# Altium project Xenon.PrjPcb
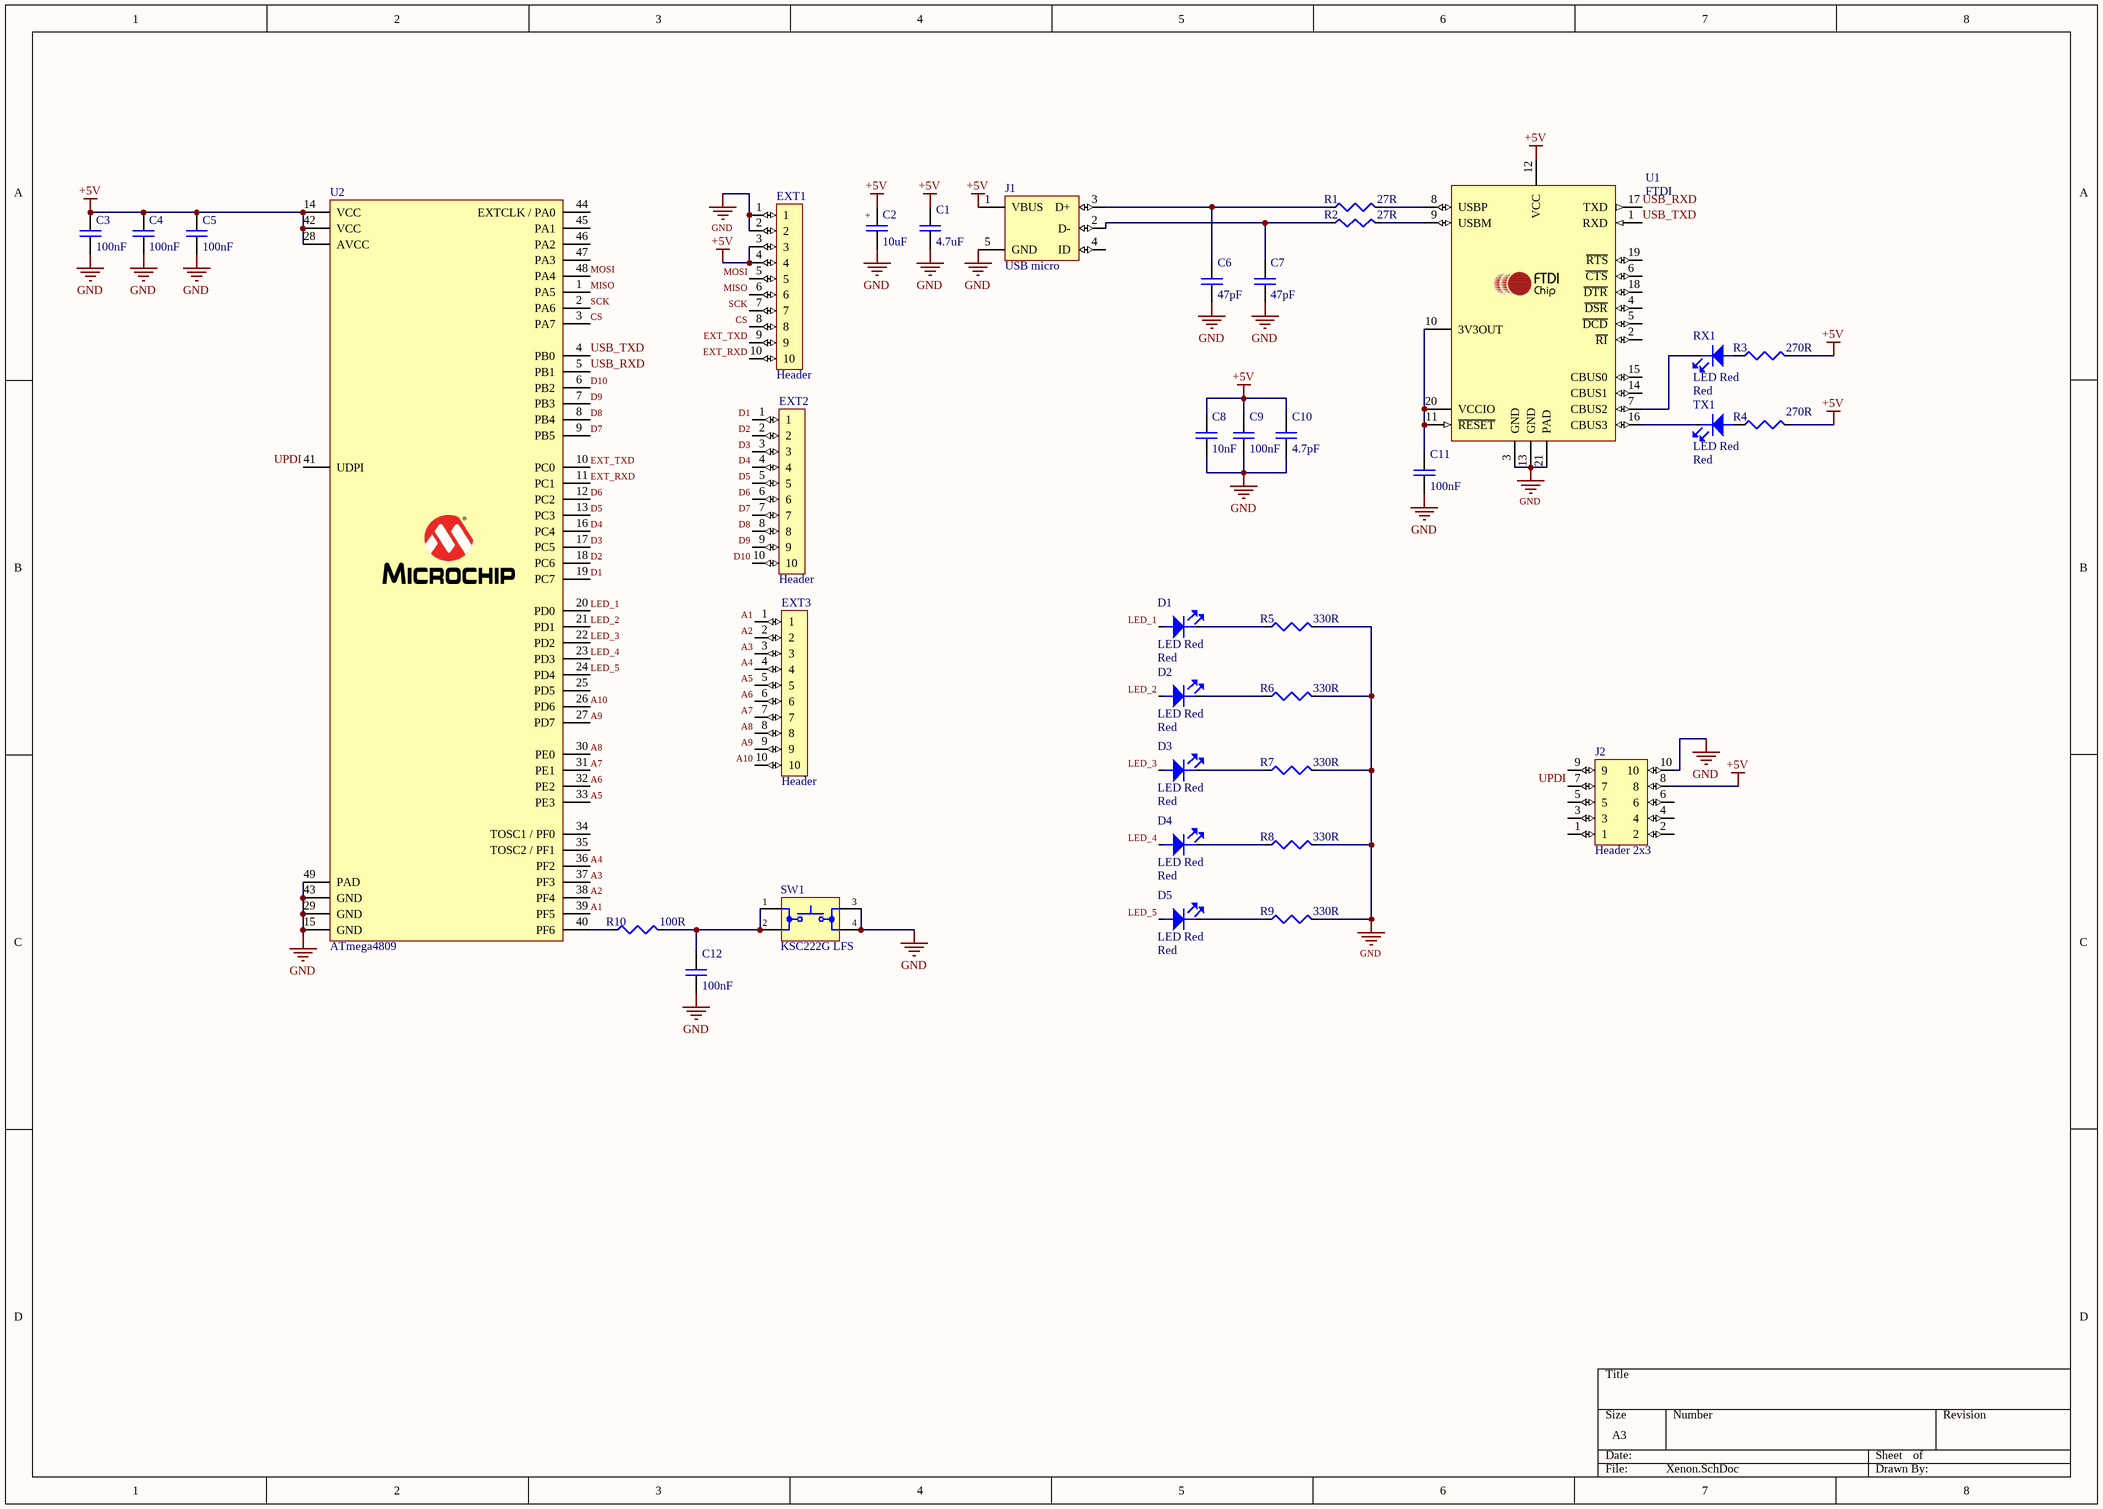
[diagram p0: Xenon.SchDoc]
1 sheet, 37 parts. Net scope: global (net labels, ports and power ports of the same name join across sheets).
Board file: Xenon.PcbDoc

## Sheet Xenon.SchDoc
size A3

### Parts
C1  value 4.7uF  [C0603]  (hidden comment: 02016D104KAT2A)
C2  value 10uF  [293D106X9020C2TE3]  (hidden comment: 293D106X9020C2TE3)
C3  value 100nF  [C0603]  (hidden comment: 02016D104KAT2A)
C4  value 100nF  [C0603]  (hidden comment: 02016D104KAT2A)
C5  value 100nF  [C0603]  (hidden comment: 02016D104KAT2A)
C6  value 47pF  [C0603]  (hidden comment: 02016D104KAT2A)
C7  value 47pF  [C0603]  (hidden comment: 02016D104KAT2A)
C8  value 10nF  [C0603]  (hidden comment: 02016D104KAT2A)
C9  value 100nF  [C0603]  (hidden comment: 02016D104KAT2A)
C10  value 4.7pF  [C0603]  (hidden comment: 02016D104KAT2A)
C11  value 100nF  [C0603]  (hidden comment: 02016D104KAT2A)
C12  value 100nF  [C0603]  (hidden comment: 02016D104KAT2A)
D1  LED Red  Color: Red  [L0603 RED]
D2  LED Red  Color: Red  [L0603 RED]
D3  LED Red  Color: Red  [L0603 RED]
D4  LED Red  Color: Red  [L0603 RED]
D5  LED Red  Color: Red  [L0603 RED]
EXT1  Header  [Header 1x10 2.54mm]
EXT2  Header  [Header 1x10 2.54mm]
EXT3  Header  [Header 1x10 2.54mm]
J1  USB micro  [USB micro]
J2  Header 2x3  [Header 2x5 1.27mm]
R1  value 27R  [R0603]  (hidden comment: CPF-A-0603B100KE1)
R2  value 27R  [R0603]  (hidden comment: CPF-A-0603B100KE1)
R3  value 270R  [R0603]  (hidden comment: CPF-A-0603B100KE1)
R4  value 270R  [R0603]  (hidden comment: CPF-A-0603B100KE1)
R5  value 330R  [R0603]  (hidden comment: CPF-A-0603B100KE1)
R6  value 330R  [R0603]  (hidden comment: CPF-A-0603B100KE1)
R7  value 330R  [R0603]  (hidden comment: CPF-A-0603B100KE1)
R8  value 330R  [R0603]  (hidden comment: CPF-A-0603B100KE1)
R9  value 330R  [R0603]  (hidden comment: CPF-A-0603B100KE1)
R10  value 100R  [R0603]  (hidden comment: CPF-A-0603B100KE1)
RX1  LED Red  Color: Red  [L0603 RED]
SW1  KSC222G LFS  [KSC222G LFS]
TX1  LED Red  Color: Red  [L0603 RED]
U1  FTDI  [FT231XQ-R]
U2  ATmega4809  [ATMEGA4809-MFR]

### Nets
+5V: C1.2 C2.1 C3.2 C4.2 C5.2 C8.2 C9.2 C10.2 EXT1.3 EXT1.4 J1.1(VBUS) J2.8 R3.2 R4.2 U1.12(VCC) U2.14(VCC) U2.28(AVCC) U2.42(VCC)
GND: C1.1 C2.2 C3.1 C4.1 C5.1 C6.1 C7.1 C8.1 C9.1 C10.1 C11.1 C12.1 EXT1.1 EXT1.2 J1.5(GND) J2.10 R5.2 R6.2 R7.2 R8.2 R9.2 SW1.3 SW1.4 U1.3(GND) U1.13(GND) U1.21(PAD) U2.15(GND) U2.29(GND) U2.43(GND) U2.49(PAD)
A1: EXT3.1 U2.39(PF5)
A2: EXT3.2 U2.38(PF4)
A3: EXT3.3 U2.37(PF3)
A4: EXT3.4 U2.36(PF2)
A5: EXT3.5 U2.33(PE3)
A6: EXT3.6 U2.32(PE2)
A7: EXT3.7 U2.31(PE1)
A8: EXT3.8 U2.30(PE0)
A9: EXT3.9 U2.27(PD7)
A10: EXT3.10 U2.26(PD6)
CS: EXT1.8 U2.3(PA7)
D1: EXT2.1 U2.19(PC7)
D2: EXT2.2 U2.18(PC6)
D3: EXT2.3 U2.17(PC5)
D4: EXT2.4 U2.16(PC4)
D5: EXT2.5 U2.13(PC3)
D6: EXT2.6 U2.12(PC2)
D7: EXT2.7 U2.9(PB5)
D8: EXT2.8 U2.8(PB4)
D9: EXT2.9 U2.7(PB3)
D10: EXT2.10 U2.6(PB2)
EXT_RXD: EXT1.10 U2.11(PC1)
EXT_TXD: EXT1.9 U2.10(PC0)
LED_1: D1.1 U2.20(PD0)
LED_2: D2.1 U2.21(PD1)
LED_3: D3.1 U2.22(PD2)
LED_4: D4.1 U2.23(PD3)
LED_5: D5.1 U2.24(PD4)
MISO: EXT1.6 U2.1(PA5)
MOSI: EXT1.5 U2.48(PA4)
SCK: EXT1.7 U2.2(PA6)
UPDI: J2.7 U2.41(UDPI)
USB_RXD: U1.17(TXD) U2.5(PB1)
USB_TXD: U1.1(RXD) U2.4(PB0)
NetC6_2: C6.2 J1.3(D+) R1.1
NetC7_2: C7.2 J1.2(D-) R2.1
NetC11_2: C11.2 U1.10(3V3OUT) U1.11(~{RESET}) U1.20(VCCIO)
NetC12_2: C12.2 R10.2 SW1.1 SW1.2
NetD1_2: D1.2 R5.1
NetD2_2: D2.2 R6.1
NetD3_2: D3.2 R7.1
NetD4_2: D4.2 R8.1
NetD5_2: D5.2 R9.1
NetR1_2: R1.2 U1.8(USBP)
NetR2_2: R2.2 U1.9(USBM)
NetR3_1: R3.1 RX1.1
NetR4_1: R4.1 TX1.1
NetR10_1: R10.1 U2.40(PF6)
NetRX1_2: RX1.2 U1.7(CBUS2)
NetTX1_2: TX1.2 U1.16(CBUS3)

Not connected (* = marked no-connect by the designer): J1 4(ID); J2 1 2 3 4 5 6 9; U1 2(~{RI}) 4(~{DSR}) 5(~{DCD}) 6(~{CTS}) 14(CBUS1) 15(CBUS0) 18(~{DTR}) 19(~{RTS}); U2 25(PD5) 34(TOSC1_/_PF0) 35(TOSC2_/_PF1) 44(EXTCLK_/_PA0) 45(PA1) 46(PA2) 47(PA3)

### Notes on the sheet
- (in symbol 293D106X9020C2TE3) +

### Library data of the parts
C1 C3-C12 = 02016D104KAT2A: C0603
C2 = 293D106X9020C2TE3: Tant. CapasitorSMD 10uF
D1-D5 RX1 TX1 = HSMG-C190: LED 0603 Red
EXT1-EXT3 = 2210S-10SG-85: Header 1x10 2.54mm male
J1 = 47590-0001
J2 = 20021111-00010T4LF: Header  2x5 1.27mm male
R1-R10 = CPF-A-0603B100KE1: R0603
SW1 = KSC222G LFS: Button SMD
U1 = FT231XQ-R: UART to USB converter
U2 = ATMEGA4809-MFR: ATmega4809 48-pin UQFN